# Altium schematic sheet 06_Zynq_PS.SchDoc
size A3; SheetNumber: 7; SheetTotal: 11
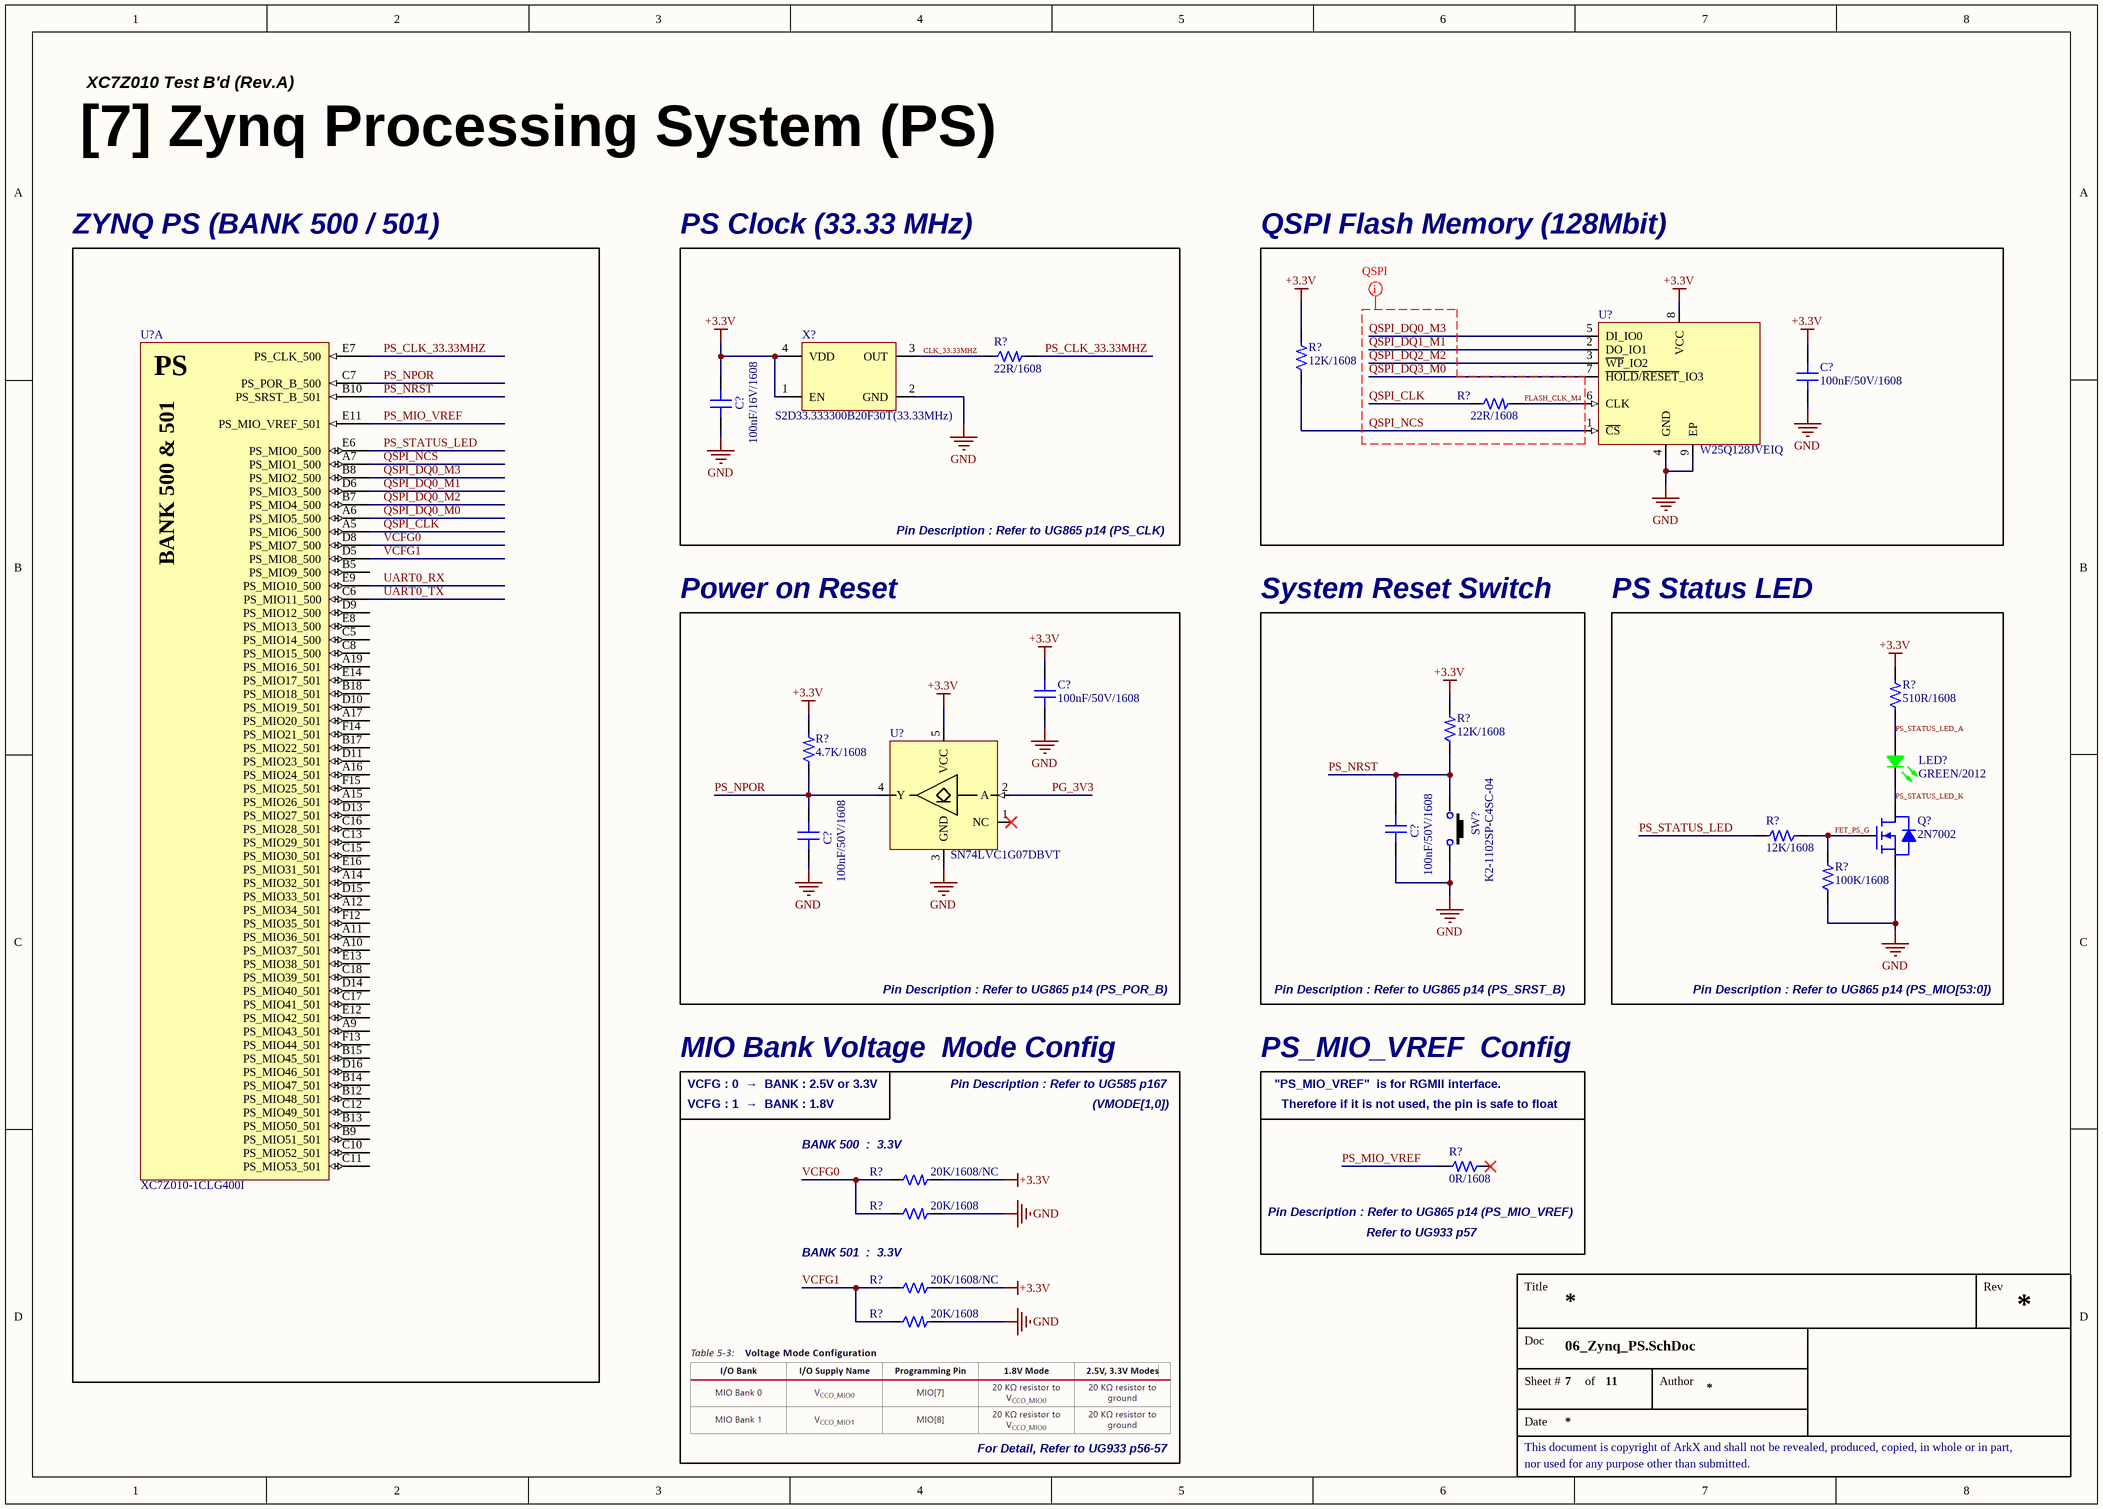
[diagram p0: 06_Zynq_PS.SchDoc]

## Parts
(Parts that share a designator on the sheet are numbered #1, #2 ... from top to bottom, then left to right.)
C?#1  100nF/50V/1608  [CAP 1608 (0603_INCH)]
C?#2  100nF/16V/1608  [CAP 1608 (0603_INCH)]
C?#3  100nF/50V/1608  [CAP 1608 (0603_INCH)]
C?#4  100nF/50V/1608  [CAP 1608 (0603_INCH)]
C?#5  100nF/50V/1608  [CAP 1608 (0603_INCH)]
LED?  GREEN/2012  [LED MHT170RGBCT (GREEN)]
Q?  2N7002  [SOT 23-3 (DIODES INCORPORATED)]
R?#1  22R/1608  [RES 1608 (0603_inch)]
R?#2  12K/1608  [RES 1608 (0603_inch)]
R?#3  22R/1608  [RES 1608 (0603_inch)]
R?#4  510R/1608  [RES 1608 (0603_inch)]
R?#5  12K/1608  [RES 1608 (0603_inch)]
R?#6  4.7K/1608  [RES 1608 (0603_inch)]
R?#7  12K/1608  [RES 1608 (0603_inch)]
R?#8  100K/1608  [RES 1608 (0603_inch)]
R?#9  0R/1608  [RES 1608 (0603_inch)]
R?#10  20K/1608/NC  [RES 1608 (0603_inch)/NC]
R?#11  20K/1608  [RES 1608 (0603_inch)]
R?#12  20K/1608/NC  [RES 1608 (0603_inch)/NC]
R?#13  20K/1608  [RES 1608 (0603_inch)]
SW?  K2-1102SP-C4SC-04  [SW K2-1102SP-C4SC-04]
U?#1  XC7Z010-1CLG400I  (part A of 9)
U?#2  W25Q128JVEIQ  [IC_WSON-8-8X6]
U?#3  SN74LVC1G07DBVT  [SOT-23-5 (TI DBV PACKAGE)]
X?  S2D33.333300B20F30T(33.33MHz)  [OSC SMD_2.5x2.0 (SCTF)]

## Blocks framed on the sheet
ZYNQ PS (BANK 500 / 501): U?#1
PS Clock (33.33 MHz): C?#2 R?#1 X?
QSPI Flash Memory (128Mbit): C?#1 R?#2 R?#3 U?#2
Power on Reset: C?#3 C?#5 R?#6 U?#3
System Reset Switch: C?#4 R?#5 SW?
PS Status LED: LED? Q? R?#4 R?#7 R?#8
MIO Bank Voltage  Mode Config: R?#10-R?#13
PS_MIO_VREF  Config: R?#9

## Nets
+3.3V: C?#1.1 C?#2.2 C?#3.1 R?#2.2 R?#4.2 R?#5.2 R?#6.2 R?#10.2 R?#12.2 U?#2.8(VCC) U?#3.5(VCC) X?.1(EN) X?.4(VDD)
GND: C?#1.2 C?#2.1 C?#3.2 C?#4.1 C?#5.1 Q?.2(S) R?#8.1 R?#11.2 R?#13.2 SW?.1 U?#2.4(GND) U?#2.9(EP) U?#3.3(GND) X?.2(GND)
CLK_33.33MHZ: R?#1.1 X?.3(OUT)
FET_PS_G: Q?.1(G) R?#7.1 R?#8.2
FLASH_CLK_M4: R?#3.2 U?#2.6(CLK)
PG_3V3: U?#3.2(A)
PS_CLK_33.33MHZ: R?#1.2 U?#1.E7(PS_CLK_500)
PS_MIO_VREF: R?#9.2 U?#1.E11(PS_MIO_VREF_501)
PS_NPOR: C?#5.2 R?#6.1 U?#1.C7(PS_POR_B_500) U?#3.4(Y)
PS_NRST: C?#4.2 R?#5.1 SW?.3 U?#1.B10(PS_SRST_B_501)
PS_STATUS_LED: R?#7.2 U?#1.E6(PS_MIO0_500)
PS_STATUS_LED_A: LED?.4(Common_Anode) R?#4.1
PS_STATUS_LED_K: LED?.2(GREEN) Q?.3(D)
QSPI_CLK: R?#3.1 U?#1.A5(PS_MIO6_500)
QSPI_DQ0_M0: U?#1.A6(PS_MIO5_500)
QSPI_DQ0_M1: U?#1.D6(PS_MIO3_500)
QSPI_DQ0_M2: U?#1.B7(PS_MIO4_500)
QSPI_DQ0_M3: U?#1.B8(PS_MIO2_500) U?#2.5(DI_IO0)
QSPI_DQ1_M1: U?#2.2(DO_IO1)
QSPI_DQ2_M2: U?#2.3(~{WP}_IO2)
QSPI_DQ3_M0: U?#2.7(~{HOLD}/~{RESET}_IO3)
QSPI_NCS: R?#2.1 U?#1.A7(PS_MIO1_500) U?#2.1(~{CS})
UART0_RX: U?#1.E9(PS_MIO10_500)
UART0_TX: U?#1.C6(PS_MIO11_500)
VCFG0: R?#10.1 R?#11.1 U?#1.D8(PS_MIO7_500)
VCFG1: R?#12.1 R?#13.1 U?#1.D5(PS_MIO8_500)

Not connected (* = marked no-connect by the designer): R?#9 1*; U?#1 A9(PS_MIO43_501) A10(PS_MIO37_501) A11(PS_MIO36_501) A12(PS_MIO34_501) A14(PS_MIO32_501) A15(PS_MIO26_501) A16(PS_MIO24_501) A17(PS_MIO20_501) A19(PS_MIO16_501) B5(PS_MIO9_500) B9(PS_MIO51_501) B12(PS_MIO48_501) B13(PS_MIO50_501) B14(PS_MIO47_501) B15(PS_MIO45_501) B17(PS_MIO22_501) B18(PS_MIO18_501) C5(PS_MIO14_500) C8(PS_MIO15_500) C10(PS_MIO52_501) C11(PS_MIO53_501) C12(PS_MIO49_501) C13(PS_MIO29_501) C15(PS_MIO30_501) C16(PS_MIO28_501) C17(PS_MIO41_501) C18(PS_MIO39_501) D9(PS_MIO12_500) D10(PS_MIO19_501) D11(PS_MIO23_501) D13(PS_MIO27_501) D14(PS_MIO40_501) D15(PS_MIO33_501) D16(PS_MIO46_501) E8(PS_MIO13_500) E12(PS_MIO42_501) E13(PS_MIO38_501) E14(PS_MIO17_501) E16(PS_MIO31_501) F12(PS_MIO35_501) F13(PS_MIO44_501) F14(PS_MIO21_501) F15(PS_MIO25_501); U?#3 1(NC)*

## Layout directives
rule Matched Net Lengths [Delay Tolerance = 20ps]; net class QSPI: FLASH_CLK_M4, QSPI_CLK, QSPI_DQ0_M3, QSPI_DQ1_M1, QSPI_DQ2_M2, QSPI_DQ3_M0, QSPI_NCS

## Notes on the sheet
- XC7Z010 Test B'd (Rev.A)
- [7] Zynq Processing System (PS)
- Pin Description : Refer to UG865 p14 (PS_CLK)
- Pin Description : Refer to UG865 p14 (PS_POR_B)
- Pin Description : Refer to UG865 p14 (PS_SRST_B)
- Pin Description : Refer to UG865 p14 (PS_MIO[53:0])
- VCFG : 0  →  BANK : 2.5V or 3.3V
- VCFG : 1  →  BANK : 1.8V
- Pin Description : Refer to UG585 p167
- (VMODE[1,0])
- "PS_MIO_VREF"  is for RGMII interface.
- Therefore if it is not used, the pin is safe to float
- (near R?#10) BANK 500  :  3.3V
- (near R?#12) BANK 501  :  3.3V
- (near R?#9) Pin Description : Refer to UG865 p14 (PS_MIO_VREF)
- Refer to UG933 p57
- For Detail, Refer to UG933 p56-57
- Title
- Rev
- Doc
- Sheet #
- of
- Author
- This document is copyright of ArkX and shall not be revealed, produced, copied, in whole or in part,
- Date
- nor used for any purpose other than submitted.
- (in symbol IC_SOC_XC7Z010-1CLG400I, part A) PS; BANK 500 & 501

## Library data of the parts
C?#1 C?#3-C?#5 = CAP_100nF/50V/1608: Ceramic CAP_100nF/50V/1608; LCSC Part #: C14663; JLCPCB Part Type: Basic Part
C?#2 = CAP_100nF/16V/1608: Ceramic CAP_100nF/16V/1608; LCSC Part #: C66501; JLCPCB Part Type: Extended Part
LED? = LED_MHT170RGBCT(GREEN): Colorless transparence -30℃~+85℃ Positive post Common anode RGB 120° 0805  Light Emitting Diodes (LED) ROHS; LCSC Part #: C2962094; JLCPCB Part Type: Extended Part
Q? = FET_2N7002: 60V 115mA 200mW 7.5Ω@10V,500mA N Channel SOT-23  MOSFETs ROHS; LCSC Part #: C8545; JLCPCB Part Type: Basic Part
R?#1 R?#3 = RES_22R/1608/0.1W: Value: 22R; Power Rating: 0.1W; Precision: 1%; Size: 1608; LCSC Part #: C23345; JLCPCB Part Type: Basic Part
R?#2 R?#5 R?#7 = RES_12K/1608/0.1W: Value: 12K; Power Rating: 0.1W; Precision: 1%; Size: 1608; LCSC Part #: C22790; JLCPCB Part Type: Basic Part
R?#4 = RES_510R/1608/0.1W: Value: 510R; Power Rating: 0.1W; Precision: 1%; Size: 1608; LCSC Part #: C23193; JLCPCB Part Type: Basic Part
R?#6 = RES_4.7K/1608/0.1W: Value: 4.7K; Power Rating: 0.1W; Precision: 1%; Size: 1608; LCSC Part #: C23162; JLCPCB Part Type: Basic Part
R?#8 = RES_100K/1608/0.1W: Value: 100K; Power Rating: 0.1W; Precision: 1%; Size: 1608; LCSC Part #: C25803; JLCPCB Part Type: Basic Part
R?#9 = RES_0R/1608/0.1W: Value: 0R; Power Rating: 0.1W; Precision: 1%; Size: 1608; LCSC Part #: C21189; JLCPCB Part Type: Basic Part
R?#10 R?#12 = RES_NC_20K/1608/0.1W: RES_20K/1608/0.1W; Value: 100R; Power Rating: 0.1W; Precision: 1%; Size: 1608
R?#11 R?#13 = RES_20K/1608/0.1W: Value: 20K; Power Rating: 0.1W; Precision: 1%; Size: 1608; LCSC Part #: C4184; JLCPCB Part Type: Basic Part
SW? = SW_K2-1102SP-C4SC-04(2P): -25℃~+85℃ 6mm 5mm Round Button 50mA Brick nogging 6mm SPST 100MΩ 100000 250gf@±30gf 12V SMD  Tactile Switches ROHS; LCSC Part #: C127509; JLCPCB Part Type: Extended Part
U?#1 = IC_SOC_XC7Z010-1CLG400I: Dual ARM® Cortex®-A9 MPCore™ with CoreSight™ System On Chip (SOC) IC Zynq®-7000 Artix™-7 FPGA, 28K Logic Cells 766MHz 400-CSPBGA (17x17)
U?#2 = IC_MEM_W25Q128JVEIQ: 3V 128M-BIT SERIAL FLASH MEMORY WITH DUAL/QUAD SPI & QPI & DTR WSON-8; Manufacturer: Winbond; Manufacturer Part Number: W25Q128JVEIQ; LCSC Part #: C401662; JLCPCB Part Type: Extended Part
U?#3 = IC_BUF_SN74LVC1G07DBVT: Single Buffer/Driver With Open-Drain Output / IC BUF NON-INVERT 5.5V SOT23-5; LCSC Part #: C2867373; JLCPCB Part Type: Extended Part
X? = OSC_S2D33.333300B20F30T(33.33MHz): 3.3V ±20ppm CMOS 33.3333MHz SMD2520-4P  Oscillators ROHS; LCSC Part #: C907622; JLCPCB Part Type: Extended Part